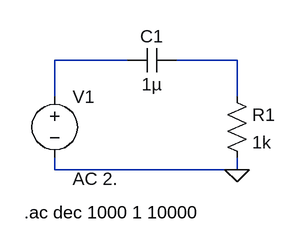
[diagram p0: schematic High_Pass_Gain.asc]
High_Pass_Gain.asc, the LTspice schematic file:
Version 4.1
SHEET 1 880 680
WIRE 80 80 -16 80
WIRE 224 80 144 80
WIRE -16 128 -16 80
WIRE 224 128 224 80
WIRE -16 224 -16 208
WIRE 224 224 224 208
WIRE 224 224 -16 224
FLAG 224 224 0
SYMBOL voltage -16 112 R0
WINDOW 123 24 124 Left 2
WINDOW 39 0 0 Left 0
SYMATTR Value2 AC 2.
SYMATTR InstName V1
SYMATTR Value ""
SYMBOL res 208 112 R0
SYMATTR InstName R1
SYMATTR Value 1k
SYMBOL cap 144 64 R90
WINDOW 0 0 32 VBottom 2
WINDOW 3 32 32 VTop 2
SYMATTR InstName C1
SYMATTR Value 1µ
TEXT -56 280 Left 2 !.ac dec 1000 1 10000

The netlist it stands for:
* High_Pass_Gain.asc
V1 N001 0 AC 2.
R1 N002 0 1k
C1 N002 N001 1µ
.ac dec 1000 1 10000
.backanno
.end